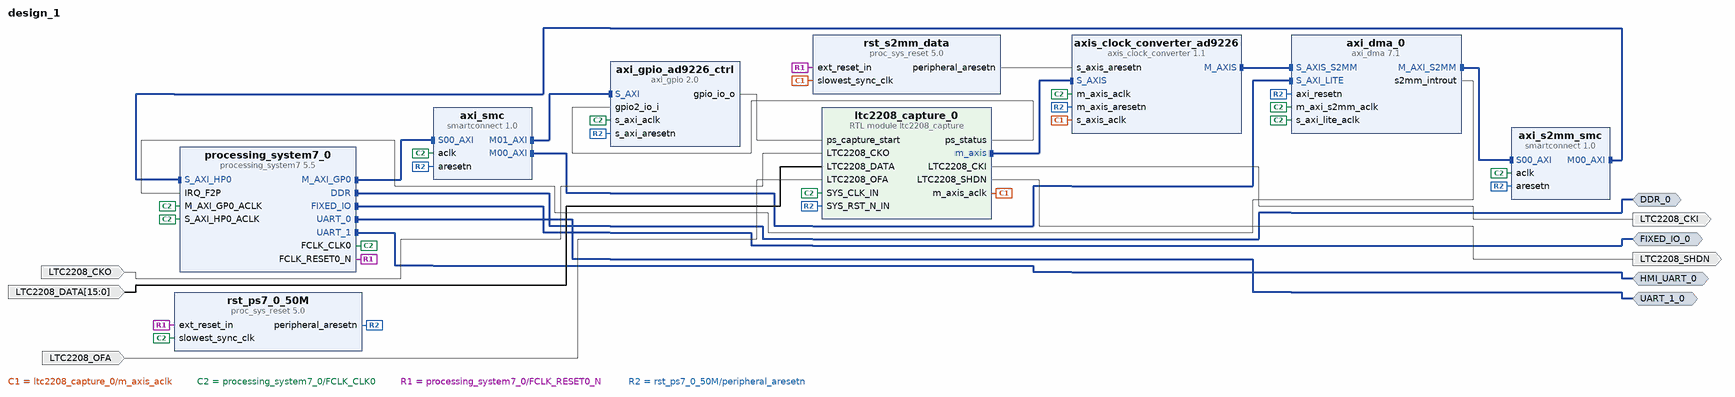
[diagram p0: block diagram of the top level]
# Vivado block design design_1, xc7z020clg484-1, Vivado 2025.2
create_bd_design design_1

create_bd_intf_port -mode Master -vlnv xilinx.com:interface:uart_rtl:1.0 UART_1_0
create_bd_intf_port -mode Master -vlnv xilinx.com:display_processing_system7:fixedio_rtl:1.0 FIXED_IO_0
create_bd_intf_port -mode Master -vlnv xilinx.com:interface:ddrx_rtl:1.0 DDR_0
create_bd_intf_port -mode Master -vlnv xilinx.com:interface:uart_rtl:1.0 HMI_UART_0
create_bd_port -dir O LTC2208_CKI
create_bd_port -dir O LTC2208_SHDN
create_bd_port -dir I LTC2208_CKO
create_bd_port -dir I LTC2208_OFA
create_bd_port -dir I -from 15 -to 0 LTC2208_DATA

create_bd_cell -type ip -vlnv xilinx.com:ip:processing_system7:5.5 processing_system7_0
set_property -dict [list \
  CONFIG.PCW_FPGA0_PERIPHERAL_FREQMHZ 100 \
  CONFIG.PCW_IRQ_F2P_INTR 1 \
  CONFIG.PCW_SD0_GRP_CD_ENABLE 1 \
  CONFIG.PCW_SD0_GRP_CD_IO {MIO 47} \
  CONFIG.PCW_SD0_GRP_WP_ENABLE 0 \
  CONFIG.PCW_SD0_PERIPHERAL_ENABLE 1 \
  CONFIG.PCW_SD0_SD0_IO {MIO 40 .. 45} \
  CONFIG.PCW_SDIO_PERIPHERAL_FREQMHZ 100 \
  CONFIG.PCW_UART0_PERIPHERAL_ENABLE 1 \
  CONFIG.PCW_UART0_UART0_IO EMIO \
  CONFIG.PCW_UART1_PERIPHERAL_ENABLE 1 \
  CONFIG.PCW_UART1_UART1_IO EMIO \
  CONFIG.PCW_UART_PERIPHERAL_FREQMHZ 100 \
  CONFIG.PCW_UIPARAM_DDR_BUS_WIDTH {16 Bit} \
  CONFIG.PCW_UIPARAM_DDR_PARTNO {MT41J256M16 RE-125} \
  CONFIG.PCW_USE_FABRIC_INTERRUPT 1 \
  CONFIG.PCW_USE_S_AXI_HP0 1 \
] [get_bd_cells processing_system7_0]
# 68 more settings of processing_system7_0 are not shown: defaults, MIO pin electricals, DDR timing, and values the tool derives
create_bd_cell -type ip -vlnv xilinx.com:ip:axi_dma:7.1 axi_dma_0
set_property -dict [list \
  CONFIG.c_include_mm2s 0 \
  CONFIG.c_include_s2mm_sf 0 \
  CONFIG.c_include_sg 0 \
  CONFIG.c_sg_length_width 23 \
] [get_bd_cells axi_dma_0]
create_bd_cell -type ip -vlnv xilinx.com:ip:smartconnect:1.0 axi_smc
set_property -dict {CONFIG.NUM_MI 2 CONFIG.NUM_SI 1} [get_bd_cells axi_smc]
create_bd_cell -type ip -vlnv xilinx.com:ip:proc_sys_reset:5.0 rst_ps7_0_50M
create_bd_cell -type ip -vlnv xilinx.com:ip:proc_sys_reset:5.0 rst_s2mm_data
create_bd_cell -type ip -vlnv xilinx.com:ip:smartconnect:1.0 axi_s2mm_smc
set_property -dict {CONFIG.NUM_MI 1 CONFIG.NUM_SI 1} [get_bd_cells axi_s2mm_smc]
create_bd_cell -type ip -vlnv xilinx.com:ip:axi_gpio:2.0 axi_gpio_ad9226_ctrl
set_property -dict [list \
  CONFIG.C_ALL_INPUTS_2 1 \
  CONFIG.C_ALL_OUTPUTS 1 \
  CONFIG.C_GPIO2_WIDTH 8 \
  CONFIG.C_GPIO_WIDTH 1 \
  CONFIG.C_IS_DUAL 1 \
] [get_bd_cells axi_gpio_ad9226_ctrl]
create_bd_cell -type ip -vlnv xilinx.com:ip:axis_clock_converter:1.1 axis_clock_converter_ad9226
create_bd_cell -type module -reference ltc2208_capture ltc2208_capture_0

# ---- connections ----

connect_bd_intf_net -intf_net ad9226test_0_m_axis1 [get_bd_intf_pins ltc2208_capture_0/m_axis] [get_bd_intf_pins axis_clock_converter_ad9226/S_AXIS]
connect_bd_intf_net [get_bd_intf_pins axi_dma_0/M_AXI_S2MM] [get_bd_intf_pins axi_s2mm_smc/S00_AXI]
connect_bd_intf_net [get_bd_intf_pins axi_s2mm_smc/M00_AXI] [get_bd_intf_pins processing_system7_0/S_AXI_HP0]
connect_bd_intf_net [get_bd_intf_pins axi_smc/M00_AXI] [get_bd_intf_pins axi_dma_0/S_AXI_LITE]
connect_bd_intf_net [get_bd_intf_pins axi_smc/M01_AXI] [get_bd_intf_pins axi_gpio_ad9226_ctrl/S_AXI]
connect_bd_intf_net [get_bd_intf_pins axis_clock_converter_ad9226/M_AXIS] [get_bd_intf_pins axi_dma_0/S_AXIS_S2MM]
connect_bd_intf_net [get_bd_intf_ports DDR_0] [get_bd_intf_pins processing_system7_0/DDR]
connect_bd_intf_net [get_bd_intf_ports FIXED_IO_0] [get_bd_intf_pins processing_system7_0/FIXED_IO]
connect_bd_intf_net [get_bd_intf_pins processing_system7_0/M_AXI_GP0] [get_bd_intf_pins axi_smc/S00_AXI]
connect_bd_intf_net [get_bd_intf_ports UART_1_0] [get_bd_intf_pins processing_system7_0/UART_0]
connect_bd_intf_net [get_bd_intf_ports HMI_UART_0] [get_bd_intf_pins processing_system7_0/UART_1]
connect_bd_net [get_bd_ports LTC2208_CKO] [get_bd_pins ltc2208_capture_0/LTC2208_CKO]
connect_bd_net [get_bd_ports LTC2208_DATA] [get_bd_pins ltc2208_capture_0/LTC2208_DATA]
connect_bd_net [get_bd_ports LTC2208_OFA] [get_bd_pins ltc2208_capture_0/LTC2208_OFA]
connect_bd_net -net ad9226test_0_m_axis_aclk [get_bd_pins ltc2208_capture_0/m_axis_aclk] \
  [get_bd_pins axis_clock_converter_ad9226/s_axis_aclk] [get_bd_pins rst_s2mm_data/slowest_sync_clk]
connect_bd_net -net ad9226test_0_ps_status [get_bd_pins ltc2208_capture_0/ps_status] [get_bd_pins axi_gpio_ad9226_ctrl/gpio2_io_i]
connect_bd_net [get_bd_pins axi_dma_0/s2mm_introut] [get_bd_pins processing_system7_0/IRQ_F2P]
connect_bd_net [get_bd_pins axi_gpio_ad9226_ctrl/gpio_io_o] [get_bd_pins ltc2208_capture_0/ps_capture_start]
connect_bd_net [get_bd_pins ltc2208_capture_0/LTC2208_CKI] [get_bd_ports LTC2208_CKI]
connect_bd_net [get_bd_pins ltc2208_capture_0/LTC2208_SHDN] [get_bd_ports LTC2208_SHDN]
connect_bd_net [get_bd_pins processing_system7_0/FCLK_CLK0] \
  [get_bd_pins axi_dma_0/s_axi_lite_aclk] [get_bd_pins axi_smc/aclk] [get_bd_pins processing_system7_0/M_AXI_GP0_ACLK] \
  [get_bd_pins rst_ps7_0_50M/slowest_sync_clk] [get_bd_pins axi_gpio_ad9226_ctrl/s_axi_aclk] \
  [get_bd_pins axis_clock_converter_ad9226/m_axis_aclk] [get_bd_pins axi_dma_0/m_axi_s2mm_aclk] \
  [get_bd_pins axi_s2mm_smc/aclk] [get_bd_pins processing_system7_0/S_AXI_HP0_ACLK] \
  [get_bd_pins ltc2208_capture_0/SYS_CLK_IN]
connect_bd_net [get_bd_pins processing_system7_0/FCLK_RESET0_N] [get_bd_pins rst_ps7_0_50M/ext_reset_in] [get_bd_pins rst_s2mm_data/ext_reset_in]
connect_bd_net [get_bd_pins rst_ps7_0_50M/peripheral_aresetn] \
  [get_bd_pins axi_dma_0/axi_resetn] [get_bd_pins axi_smc/aresetn] [get_bd_pins axi_gpio_ad9226_ctrl/s_axi_aresetn] \
  [get_bd_pins axis_clock_converter_ad9226/m_axis_aresetn] [get_bd_pins ltc2208_capture_0/SYS_RST_N_IN] \
  [get_bd_pins axi_s2mm_smc/aresetn]
connect_bd_net [get_bd_pins rst_s2mm_data/peripheral_aresetn] [get_bd_pins axis_clock_converter_ad9226/s_axis_aresetn]

# ---- address map ----
assign_bd_address -offset 0x00000000 -range 512M -target_address_space [get_bd_addr_spaces axi_dma_0/Data_S2MM] [get_bd_addr_segs processing_system7_0/S_AXI_HP0/HP0_DDR_LOWOCM]
assign_bd_address -offset 0x40400000 -range 64K -target_address_space [get_bd_addr_spaces processing_system7_0/Data] [get_bd_addr_segs axi_dma_0/S_AXI_LITE/Reg]
assign_bd_address -offset 0x41200000 -range 64K -target_address_space [get_bd_addr_spaces processing_system7_0/Data] [get_bd_addr_segs axi_gpio_ad9226_ctrl/S_AXI/Reg]

validate_bd_design
save_bd_design
